# Altium schematic sheet Regulators.SchDoc
size Letter; CompanyName: Ploopy Corporation; Organization: Ploopy Corporation; Address1: 137-1140 Burnhamthorpe Road W; Address2: Mississauga; Address3: Ontario; Address4: Canada L5C 0A3; DocumentNumber: 8; Revision: R1.001; SheetNumber: 8; SheetTotal: 8
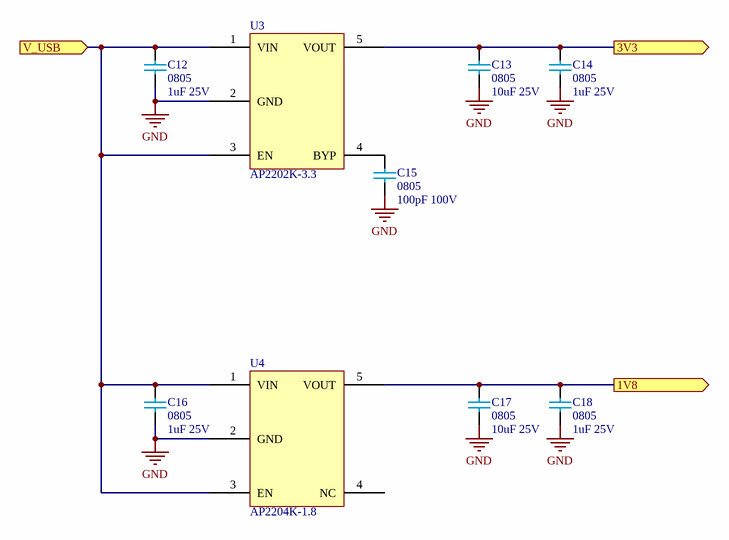
[diagram p0: Regulators.SchDoc]

## Parts
C12  0805  value 1uF 25V  [0805]
C13  0805  value 10uF 25V  [0805]
C14  0805  value 1uF 25V  [0805]
C15  0805  value 100pF 100V  [0805]
C16  0805  value 1uF 25V  [0805]
C17  0805  value 10uF 25V  [0805]
C18  0805  value 1uF 25V  [0805]
U3  AP2202K-3.3  [AP2202 - SOT95P270X145-5N]
U4  AP2204K-1.8  [AP2202 - SOT95P270X145-5N]

## Ports
1V8 (out), 3V3 (out), V_USB (in)

## Nets
GND: C12.1 C13.1 C14.1 C15.1 C16.1 C17.1 C18.1 U3.2(GND) U4.2(GND)
1V8: C17.2 C18.2 U4.5(VOUT) ; port 1V8
3V3: C13.2 C14.2 U3.5(VOUT) ; port 3V3
V_USB: C12.2 C16.2 U3.1(VIN) U3.3(EN) U4.1(VIN) U4.3(EN) ; port V_USB
NetC15_2: C15.2 U3.4(BYP)

Not connected (* = marked no-connect by the designer): U4 4(NC)

## Notes on the sheet
- Copyright Ploopy Corporation 2021
- Licensed under the CERN-OHL-S v2
- http://ohwr.org/cernohl
- Title:
- PCB:
- Version:
- Ploopy Corporation
- Mississauga ON L5C 0A3
- 137-1140 Burnhamthorpe Road W
- Date:
- Time:
- Sheet
- of
- Canada

## Library data of the parts
C12 C14 C16 C18 = Cap 1uF 25V: 0805, X5R or better; PNP-Nzl: 2; PNP-dx: 0; PNP-Level: 1; PNP-Thk: 1.25; PNP-TS: 70; PNP-Type: chi; PNP-X: 2.00; PNP-FeedType: Tape; PNP-TapeWidth: 8; Supplier 1: Digi-Key; Supplier Part Number 1: 1276-1066-2-ND; Supplier 2: Digi-Key; Supplier Part Number 2: 1276-1066-1-ND; PNP-dy: 0; PNP-Lv: 1; PNP-Pt: 0; PNP-Voff: 0; PNP-W: 0; PNP-Y: 1.25; PNP-A: 0; PNP-PlacePriority: 1; PNP-TapeIndex: 1; PNP-da: 0
C13 C17 = Cap 10uF 25V: 0805, X5R or better; PNP-Nzl: 2; PNP-dx: 0; PNP-X: 2.00; PNP-Y: 1.25; PNP-Lv: 1; PNP-TS: 70; PNP-Type: chi; PNP-FeedType: Tape; PNP-TapeWidth: 8; PNP-dy: 0; PNP-Pt: 0; PNP-W: 0; PNP-Thk: 1.25; PNP-Level: 1; PNP-Voff: 0; PNP-PlacePriority: 1; PNP-A: 0; PNP-TapeIndex: 1; Supplier 1: Mouser; Supplier Part Number 1: 81-GRM21BR61E106KA3L; Supplier 2: Digi-Key; Supplier Part Number 2: 490-5523-1-ND; PNP-da: 0
C15 = Cap 100pF 100V: 0805, X5R or better; PNP-Nzl: 2; PNP-dx: 0; PNP-X: 2.00; PNP-Y: 1.25; PNP-Thk: 0.60; PNP-Lv: 1; PNP-TS: 70; PNP-Type: chi; PNP-FeedType: Tape; PNP-TapeWidth: 8; Supplier 1: Digi-Key; Supplier Part Number 1: 1276-2426-1-ND; Supplier 2: Digi-Key; Supplier Part Number 2: 1276-2426-2-ND; PNP-dy: 0; PNP-Pt: 0; PNP-W: 0; PNP-Level: 1; PNP-Voff: 0; PNP-PlacePriority: 1; PNP-A: 0; PNP-TapeIndex: 1; Supplier 3: Arrow; Supplier Part Number 3: L5XIfgkrxsBQF2sGZ85JNyFE59-nywaq7sHwLppiklbTEIlO4Ffw3x4_A6bjf4Mm; PNP-da: 0
U3 = AP2202K-3.3: 3.3V 150mA LDO regulator; PNP-Nzl: 2; PNP-dx: 0; PNP-X: 2.9; PNP-Y: 1.3; PNP-A: 90; PNP-Thk: 1; PNP-Lv: 26; PNP-Type: CHP; PNP-FeedType: Tape; PNP-TapeWidth: 8; PNP-PlacePriority: 3; PNP-dy: 0; PNP-Pt: 0; PNP-W: 0; PNP-TS: 90; PNP-Level: 1; PNP-Voff: 0; PNP-TapeIndex: 1; Supplier 1: Mouser; Supplier Part Number 1: 621-AP2202K-3.3TRG1; Supplier 2: Digi-Key; Supplier Part Number 2: AP2202K-3.3TRG1DICT-ND; Supplier 3: Arrow; Supplier Part Number 3: PWagzdsTFFHKE_U17B45SP-NtndBrheJIaI5hB7gHD0ZVywxIBNyoAQstvnyfZZ0; PNP-da: 0
U4 = AP2204K-1.8: Linear Voltage Regulator IC 1 Output 150mA SOT-23-5; PNP-Nzl: 2; PNP-dx: 0; PNP-X: 2.9; PNP-Y: 1.3; PNP-A: 90; PNP-Thk: 1; PNP-Lv: 26; PNP-Type: CHP; PNP-FeedType: Tape; PNP-TapeWidth: 8; PNP-PlacePriority: 3; PNP-dy: 0; PNP-Pt: 0; PNP-W: 0; PNP-TS: 90; PNP-Level: 1; PNP-Voff: 0; PNP-TapeIndex: 1; PNP-da: 0; Supplier 1: Digi-Key; Supplier 2: Mouser; Supplier Part Number 1: AP2204K-1.8TRG1DICT-ND; Supplier Part Number 2: 621-AP2204K-1.8TRG1